# Altium schematic sheet alim.SchDoc
size A4
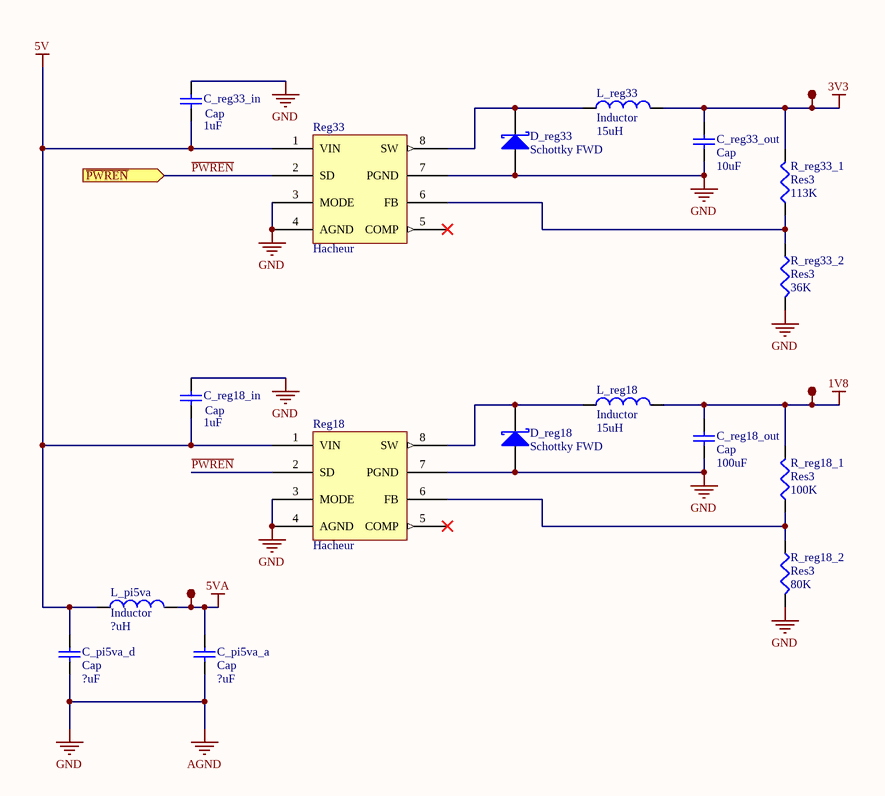
[diagram p0: alim.SchDoc]

## Parts
C_pi5va_a  Cap  value ?uF  [0805]
C_pi5va_d  Cap  value ?uF  [0805]
C_reg18_in  Cap  value 1uF  [0805]
C_reg18_out  Cap  value 100uF  [0805]
C_reg33_in  Cap  value 1uF  [0805]
C_reg33_out  Cap  value 10uF  [0805]
D_reg18  Schottky FWD  [Diode]
D_reg33  Schottky FWD  [Diode]
L_pi5va  Inductor  value ?uH  [0805]
L_reg18  Inductor  value 15uH  [Bobine_alim]
L_reg33  Inductor  value 15uH  [Bobine_alim]
R_reg18_1  Res3  value 100K  [0805]
R_reg18_2  Res3  value 80K  [0805]
R_reg33_1  Res3  value 113K  [0805]
R_reg33_2  Res3  value 36K  [0805]
Reg18  Hacheur  [SOIC8_M]
Reg33  Hacheur  [SOIC8_M]
TP_1v8  TestPoint  [testpoint]  (value not drawn)
TP_3v3  TestPoint  [testpoint]  (value not drawn)
TP_5va  TestPoint  [testpoint]  (value not drawn)

## Ports
~{PWREN} (in)

## Nets
1V8: C_reg18_out.1 L_reg18.2 R_reg18_1.2 TP_1v8.1(TP)
3V3: C_reg33_out.1 L_reg33.2 R_reg33_1.2 TP_3v3.1(TP)
5V: C_pi5va_d.1 C_reg18_in.2 C_reg33_in.2 L_pi5va.1 Reg18.1(VIN) Reg33.1(VIN)
5VA: C_pi5va_a.1 L_pi5va.2 TP_5va.1(TP)
AGND: C_pi5va_a.2 C_pi5va_d.2 C_reg18_in.1 C_reg18_out.2 C_reg33_in.1 C_reg33_out.2 D_reg18.1(A) D_reg33.1(A) R_reg18_2.2 R_reg33_2.2 Reg18.3(MODE) Reg18.4(AGND) Reg18.7(PGND) Reg33.3(MODE) Reg33.4(AGND) Reg33.7(PGND)  [also labelled GND]
~{PWREN}: Reg18.2(SD) Reg33.2(SD) ; port ~{PWREN}
NetD_reg18_2: D_reg18.2(K) L_reg18.1 Reg18.8(SW)
NetD_reg33_2: D_reg33.2(K) L_reg33.1 Reg33.8(SW)
NetR_reg18_1_1: R_reg18_1.1 R_reg18_2.1 Reg18.6(FB)
NetR_reg33_1_1: R_reg33_1.1 R_reg33_2.1 Reg33.6(FB)

Not connected (* = marked no-connect by the designer): Reg18 5(COMP)*; Reg33 5(COMP)*

## Library data of the parts
C_pi5va_a C_pi5va_d C_reg18_in C_reg18_out C_reg33_in C_reg33_out = Cap: Capacitor; Published: 8-Jun-2000; LatestRevisionDate: 17-Jul-2002; LatestRevisionNote: Re-released for DXP Platform.; PackageReference: RAD-0.3; Publisher: Altium Limited
D_reg18 D_reg33 = Diode BAT17: Silicon RF Schottky Diode for Mixer Applications in the VHF/UHF Range; Note: Pin 2 is not connected and not drawn.; Published: 21-Mar-2003; LatestRevisionDate: 29-May-2009; LatestRevisionNote: IPC-7351 Footprint Added.; DatasheetVersion: Oct-1999; PackageVersion: Sep-2001; PackageReference: SOT-23; Publisher: Altium Limited; PackageDescription: 3-Pin SOT-23 Package 0.95 mm Pitch, 2.5 mm Lead Span; ComponentLink1Description: Manufacturer Link; ComponentLink1URL: http://www.infineon.com/; ComponentLink2Description: Datasheet; ComponentLink2URL: http://www.infineon.com/upload/Document/cmc_upload/documents/009/363/bat17series.pdf
L_pi5va L_reg18 L_reg33 = Inductor: Code_IEC: 1005; Published: 8-Jun-2000; LatestRevisionDate: 29-May-2009; LatestRevisionNote: IPC-7351 Footprint Added.; PackageReference: 0402-A; Publisher: Altium Limited; PackageDescription: Chip Inductor; Code_JEITA: 0402
R_reg18_1 R_reg18_2 R_reg33_1 R_reg33_2 = Res3: Resistor; Published: 8-Jun-2000; LatestRevisionDate: 29-May-2009; LatestRevisionNote: IPC-7351 Footprint Added.; PackageReference: J1-0603; Publisher: Altium Limited; PackageDescription: Chip Resistor